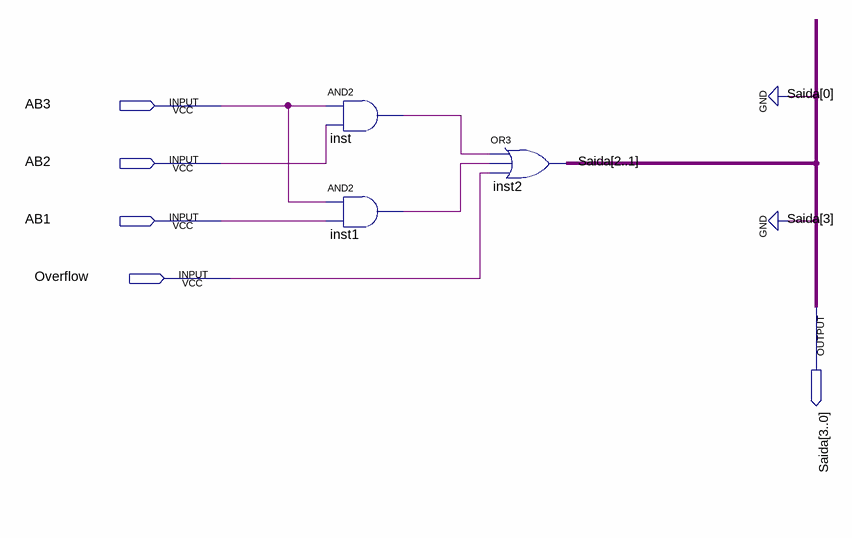
[diagram p0: schematic sheet]
// Quartus schematic bloquinho.bdf as structural Verilog: 3 symbols, 5 pins
module bloquinho (
  input  AB3,
  input  AB2,
  input  AB1,
  input  Overflow,
  output [3:0] Saida
);

  wire inst1_out, inst_out;

  and inst (inst_out, AB3, AB2);
  and inst1 (inst1_out, AB3, AB1);
  assign Saida[2:1] = {2{inst_out}} | {2{inst1_out}} | {2{Overflow}};  // OR3 inst2, 2 bits wide

  assign {Saida[3], Saida[0]} = 2'b00;
endmodule
